# Altium schematic sheet DualETH_CON.SchDoc
size 420 x 297 mm; SheetNumber: 7; SheetTotal: 11; ModifiedBy: -; CheckedDate: -; Title2: Title 2; DivGrp: WUT ISE; Designer: G.Kasprowicz
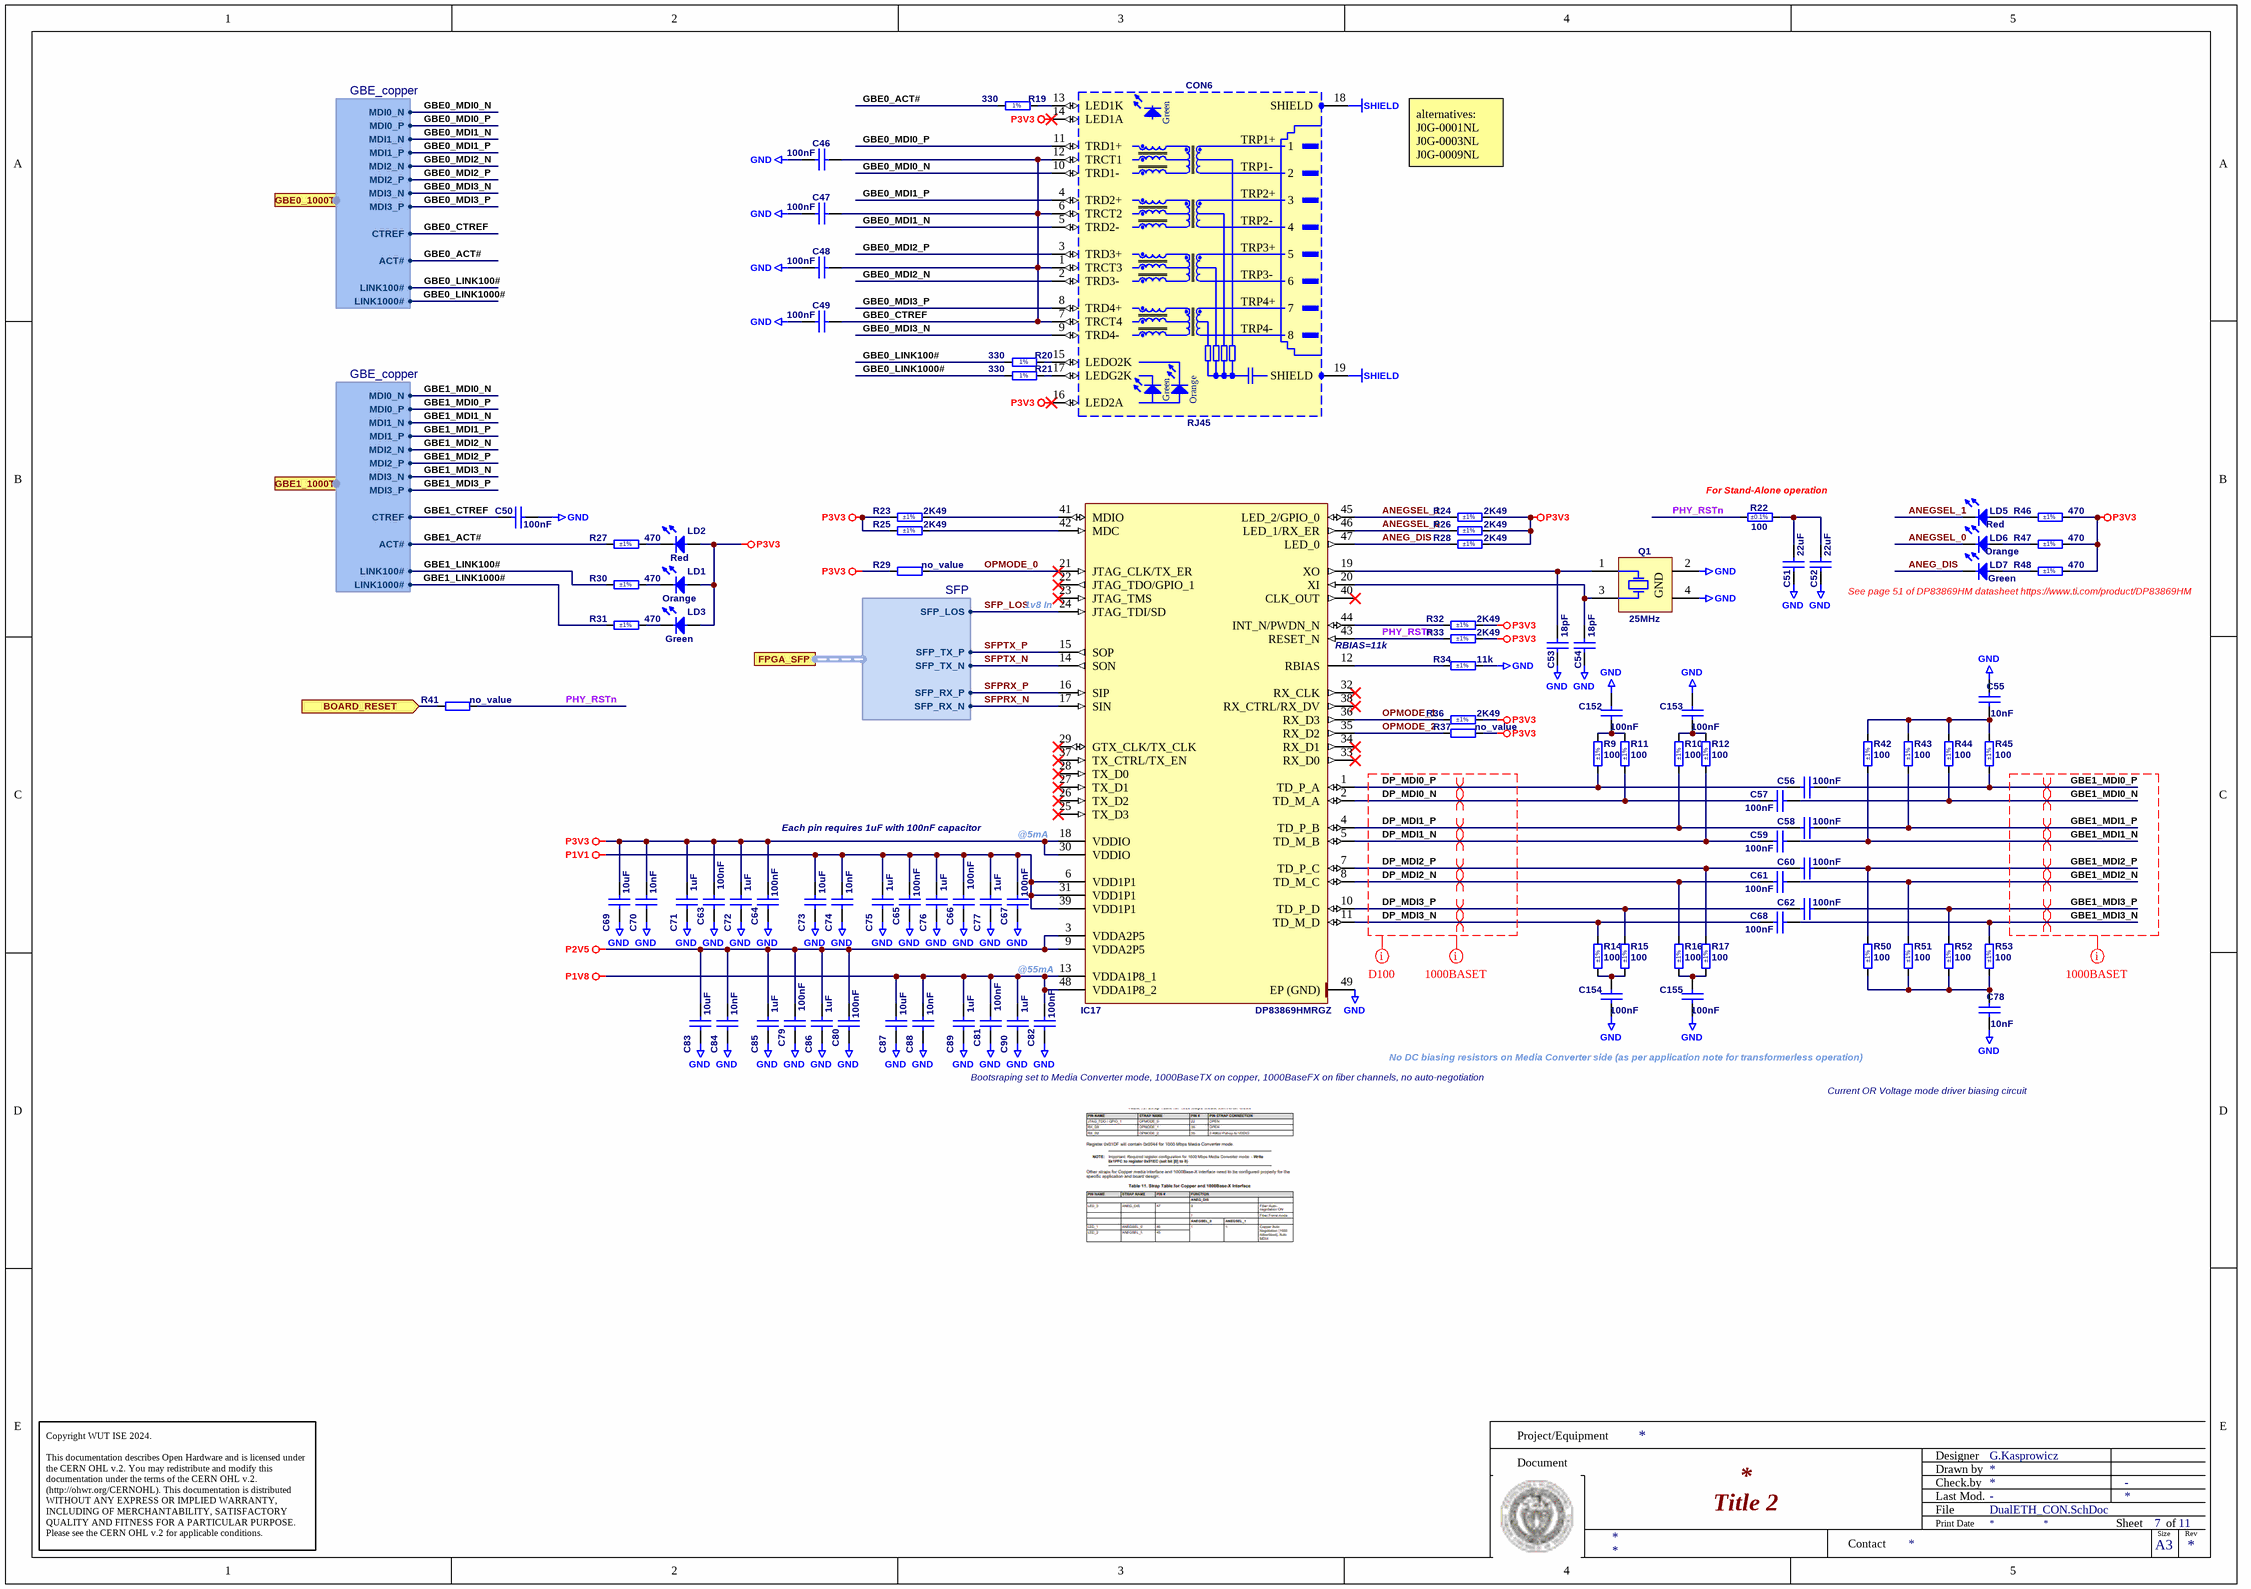
[diagram p0: DualETH_CON.SchDoc]

## Parts
C46  100nF  [CAPC1005X55N]
C47  100nF  [CAPC1005X55N]
C48  100nF  [CAPC1005X55N]
C49  100nF  [CAPC1005X55N]
C50  100nF  [CAPC1005X55N]
C51  22uF  [CAPC2012X135N]
C52  22uF  [CAPC2012X135N]
C53  18pF  [CAPC1005X55N]
C54  18pF  [CAPC1005X55N]
C55  10nF  [CAPC1005X55N]
C56  100nF  [CAPC1005X55N]
C57  100nF  [CAPC1005X55N]
C58  100nF  [CAPC1005X55N]
C59  100nF  [CAPC1005X55N]
C60  100nF  [CAPC1005X55N]
C61  100nF  [CAPC1005X55N]
C62  100nF  [CAPC1005X55N]
C63  100nF  [CAPC1005X55N]
C64  100nF  [CAPC1005X55N]
C65  100nF  [CAPC1005X55N]
C66  100nF  [CAPC1005X55N]
C67  100nF  [CAPC1005X55N]
C68  100nF  [CAPC1005X55N]
C69  10uF  [CAPC1608X80N]
C70  10nF  [CAPC1005X55N]
C71  1uF  [CAPC1005X55N]
C72  1uF  [CAPC1005X55N]
C73  10uF  [CAPC1608X80N]
C74  10nF  [CAPC1005X55N]
C75  1uF  [CAPC1005X55N]
C76  1uF  [CAPC1005X55N]
C77  1uF  [CAPC1005X55N]
C78  10nF  [CAPC1005X55N]
C79  100nF  [CAPC1005X55N]
C80  100nF  [CAPC1005X55N]
C81  100nF  [CAPC1005X55N]
C82  100nF  [CAPC1005X55N]
C83  10uF  [CAPC1608X80N]
C84  10nF  [CAPC1005X55N]
C85  1uF  [CAPC1005X55N]
C86  1uF  [CAPC1005X55N]
C87  10uF  [CAPC1608X80N]
C88  10nF  [CAPC1005X55N]
C89  1uF  [CAPC1005X55N]
C90  1uF  [CAPC1005X55N]
C152  100nF  [CAPC1005X55N]
C153  100nF  [CAPC1005X55N]
C154  100nF  [CAPC1005X55N]
C155  100nF  [CAPC1005X55N]
CON6  RJ45  [BELFUSE_L829-1J1T-43]
IC17  DP83869HMRGZ  [QFN50P700X700X100-49N-S420]
LD1  Orange  [LED_DIALIGHT_597-2111-407F]
LD2  Red  [LED_DIALIGHT_597-2111-407F]
LD3  Green  [LED_DIALIGHT_597-2111-407F]
LD5  Red  [LED_DIALIGHT_597-2111-407F]
LD6  Orange  [LED_DIALIGHT_597-2111-407F]
LD7  Green  [LED_DIALIGHT_597-2111-407F]
Q1  25MHz  [XTAL_EPSON_TSX-3225]
R9  100  Tolerance: ±1%  [RESC1005X40N]
R10  100  Tolerance: ±1%  [RESC1005X40N]
R11  100  Tolerance: ±1%  [RESC1005X40N]
R12  100  Tolerance: ±1%  [RESC1005X40N]
R14  100  Tolerance: ±1%  [RESC1005X40N]
R15  100  Tolerance: ±1%  [RESC1005X40N]
R16  100  Tolerance: ±1%  [RESC1005X40N]
R17  100  Tolerance: ±1%  [RESC1005X40N]
R19  330  [RESC1608X55N]
R20  330  [RESC1608X55N]
R21  330  [RESC1608X55N]
R22  100  Tolerance: ±0.1%  [RESC1005X35N]
R23  2K49  Tolerance: ±1%  [RESC1005X40N]
R24  2K49  Tolerance: ±1%  [RESC1005X40N]
R25  2K49  Tolerance: ±1%  [RESC1005X40N]
R26  2K49  Tolerance: ±1%  [RESC1005X40N]
R27  470  Tolerance: ±1%  [RESC1005X40N]
R28  2K49  Tolerance: ±1%  [RESC1005X40N]
R29  no_value  [RESC1005X40N]  (no BOM)
R30  470  Tolerance: ±1%  [RESC1005X40N]
R31  470  Tolerance: ±1%  [RESC1005X40N]
R32  2K49  Tolerance: ±1%  [RESC1005X40N]
R33  2K49  Tolerance: ±1%  [RESC1005X40N]
R34  11k  Tolerance: ±1%  [RESC1005X40N]
R36  2K49  Tolerance: ±1%  [RESC1005X40N]
R37  no_value  [RESC1005X40N]  (no BOM)
R41  no_value  [RESC1005X40N]  (no BOM)
R42  100  Tolerance: ±1%  [RESC1005X40N]
R43  100  Tolerance: ±1%  [RESC1005X40N]
R44  100  Tolerance: ±1%  [RESC1005X40N]
R45  100  Tolerance: ±1%  [RESC1005X40N]
R46  470  Tolerance: ±1%  [RESC1005X40N]
R47  470  Tolerance: ±1%  [RESC1005X40N]
R48  470  Tolerance: ±1%  [RESC1005X40N]
R50  100  Tolerance: ±1%  [RESC1005X40N]
R51  100  Tolerance: ±1%  [RESC1005X40N]
R52  100  Tolerance: ±1%  [RESC1005X40N]
R53  100  Tolerance: ±1%  [RESC1005X40N]

## Ports
BOARD_RESET (in), FPGA_SFP (harness SFP), GBE0_1000T (harness GBE_copper), GBE1_1000T (harness GBE_copper)

## Harnesses
GBE_copper: MDI2_P, MDI3_N, MDI2_N, MDI3_P, MDI1_P, MDI0_N, MDI1_N, MDI0_P, ACT#, LINK100#, LINK1000#, CTREF
SFP: SFP_TX_P, SFP_TX_N, SFP_RX_P, SFP_RX_N, SFP_LOS

## Nets
GND: C46.1 C47.1 C48.1 C49.1 C50.1 C51.1 C52.1 C53.1 C54.1 C55.2 C63.1 C64.1 C65.1 C66.1 C67.1 C69.1 C70.1 C71.1 C72.1 C73.1 C74.1 C75.1 C76.1 C77.1 C78.1 C79.1 C80.1 C81.1 C82.1 C83.1 C84.1 C85.1 C86.1 C87.1 C88.1 C89.1 C90.1 C152.2 C153.2 C154.1 C155.1 IC17.49(EP_(GND)) Q1.2(GND) Q1.4(GND) R34.2
P1V1: C65.2 C66.2 C67.2 C73.2 C74.2 C75.2 C76.2 C77.2 IC17.6(VDD1P1) IC17.31(VDD1P1) IC17.39(VDD1P1)
P1V8: C81.2 C82.2 C87.2 C88.2 C89.2 C90.2 IC17.13(VDDA1P8_1) IC17.48(VDDA1P8_2)
P2V5: C79.2 C80.2 C83.2 C84.2 C85.2 C86.2 IC17.3(VDDA2P5) IC17.9(VDDA2P5)
P3V3: C63.2 C64.2 C69.2 C70.2 C71.2 C72.2 CON6.14(LED1A) CON6.16(LED2A) IC17.18(VDDIO) IC17.30(VDDIO) LD1.2(A) LD2.2(A) LD3.2(A) R23.1 R24.2 R25.1 R26.2 R28.2 R29.1 R32.2 R33.2 R36.2 R37.2 R46.2 R47.2 R48.2
SHIELD: CON6.18(SHIELD) CON6.19(SHIELD)
BOARD_RESET: R41.1 ; port BOARD_RESET
ANEG_DIS: IC17.47(LED_0) LD7.1(C) R28.1
ANEGSEL_0: IC17.46(LED_1/RX_ER) LD6.1(C) R26.1
ANEGSEL_1: IC17.45(LED_2/GPIO_0) LD5.1(C) R24.1
DP_MDI0_N: C57.1 IC17.2(TD_M_A) R11.1
DP_MDI0_P: C56.1 IC17.1(TD_P_A) R9.1
DP_MDI1_N: C59.1 IC17.5(TD_M_B) R12.1
DP_MDI1_P: C58.1 IC17.4(TD_P_B) R10.1
DP_MDI2_N: C61.1 IC17.8(TD_M_C) R16.2
DP_MDI2_P: C60.1 IC17.7(TD_P_C) R17.2
DP_MDI3_N: C68.1 IC17.11(TD_M_D) R14.2
DP_MDI3_P: C62.1 IC17.10(TD_P_D) R15.2
GBE0_ACT#: R19.1 ; port GBE0_1000T.ACT#
GBE0_CTREF: C46.2 C47.2 C48.2 C49.2 CON6.1(TRCT3) CON6.6(TRCT2) CON6.7(TRCT4) CON6.12(TRCT1) ; port GBE0_1000T.CTREF
GBE0_LINK100#: R20.1 ; port GBE0_1000T.LINK100#
GBE0_LINK1000#: R21.1 ; port GBE0_1000T.LINK1000#
GBE0_MDI0_N: CON6.10(TRD1-) ; port GBE0_1000T.MDI0_N
GBE0_MDI0_P: CON6.11(TRD1+) ; port GBE0_1000T.MDI0_P
GBE0_MDI1_N: CON6.5(TRD2-) ; port GBE0_1000T.MDI1_N
GBE0_MDI1_P: CON6.4(TRD2+) ; port GBE0_1000T.MDI1_P
GBE0_MDI2_N: CON6.2(TRD3-) ; port GBE0_1000T.MDI2_N
GBE0_MDI2_P: CON6.3(TRD3+) ; port GBE0_1000T.MDI2_P
GBE0_MDI3_N: CON6.9(TRD4-) ; port GBE0_1000T.MDI3_N
GBE0_MDI3_P: CON6.8(TRD4+) ; port GBE0_1000T.MDI3_P
GBE1_ACT#: R27.1 ; port GBE1_1000T.ACT#
GBE1_CTREF: C50.2 ; port GBE1_1000T.CTREF
GBE1_LINK100#: R30.1 ; port GBE1_1000T.LINK100#
GBE1_LINK1000#: R31.1 ; port GBE1_1000T.LINK1000#
GBE1_MDI0_N: C57.2 R44.1 ; port GBE1_1000T.MDI0_N
GBE1_MDI0_P: C56.2 R45.1 ; port GBE1_1000T.MDI0_P
GBE1_MDI1_N: C59.2 R42.1 ; port GBE1_1000T.MDI1_N
GBE1_MDI1_P: C58.2 R43.1 ; port GBE1_1000T.MDI1_P
GBE1_MDI2_N: C61.2 R51.2 ; port GBE1_1000T.MDI2_N
GBE1_MDI2_P: C60.2 R50.2 ; port GBE1_1000T.MDI2_P
GBE1_MDI3_N: C68.2 R53.2 ; port GBE1_1000T.MDI3_N
GBE1_MDI3_P: C62.2 R52.2 ; port GBE1_1000T.MDI3_P
OPMODE_0: IC17.21(JTAG_CLK/TX_ER) R29.2
OPMODE_1: IC17.36(RX_D3) R36.1
OPMODE_2: IC17.35(RX_D2) R37.1
PHY_RSTn: IC17.43(RESET_N) R22.1 R33.1 R41.2
SFP_LOS: IC17.24(JTAG_TDI/SD) ; port FPGA_SFP.SFP_LOS
SFPRX_N: IC17.17(SIN) ; port FPGA_SFP.SFP_RX_N
SFPRX_P: IC17.16(SIP) ; port FPGA_SFP.SFP_RX_P
SFPTX_N: IC17.14(SON) ; port FPGA_SFP.SFP_TX_N
SFPTX_P: IC17.15(SOP) ; port FPGA_SFP.SFP_TX_P
NetC51_2: C51.2 C52.2 R22.2
NetC53_2: C53.2 IC17.19(XO) Q1.1(X)
NetC54_2: C54.2 IC17.20(XI) Q1.3(X)
NetC55_1: C55.1 R42.2 R43.2 R44.2 R45.2
NetC78_2: C78.2 R50.1 R51.1 R52.1 R53.1
NetC152_1: C152.1 R9.2 R11.2
NetC153_1: C153.1 R10.2 R12.2
NetC154_2: C154.2 R14.1 R15.1
NetC155_2: C155.2 R16.1 R17.1
NetCON6_13: CON6.13(LED1K) R19.2
NetCON6_15: CON6.15(LEDO2K) R20.2
NetCON6_17: CON6.17(LEDG2K) R21.2
NetIC17_12: IC17.12(RBIAS) R34.1
NetIC17_41: IC17.41(MDIO) R23.2
NetIC17_42: IC17.42(MDC) R25.2
NetIC17_44: IC17.44(INT_N/PWDN_N) R32.1
NetLD1_1: LD1.1(C) R30.2
NetLD2_1: LD2.1(C) R27.2
NetLD3_1: LD3.1(C) R31.2
NetLD5_2: LD5.2(A) R46.1
NetLD6_2: LD6.2(A) R47.1
NetLD7_2: LD7.2(A) R48.1

Not connected (* = marked no-connect by the designer): IC17 22(JTAG_TDO/GPIO_1)* 23(JTAG_TMS)* 25(TX_D3)* 26(TX_D2)* 27(TX_D1)* 28(TX_D0)* 29(GTX_CLK/TX_CLK)* 32(RX_CLK)* 33(RX_D0)* 34(RX_D1)* 37(TX_CTRL/TX_EN)* 38(RX_CTRL/RX_DV)* 40(CLK_OUT)*

## Layout directives
differential pair: DP_MDI0_N, DP_MDI0_P, DP_MDI1_N, DP_MDI1_P, DP_MDI2_N, DP_MDI2_P, DP_MDI3_N, DP_MDI3_P, GBE1_MDI0_N, GBE1_MDI0_P, GBE1_MDI1_N, GBE1_MDI1_P, GBE1_MDI2_N, GBE1_MDI2_P, GBE1_MDI3_N, GBE1_MDI3_P
net class D100: DP_MDI0_N, DP_MDI0_P, DP_MDI1_N, DP_MDI1_P, DP_MDI2_N, DP_MDI2_P, DP_MDI3_N, DP_MDI3_P
net class 1000BASET: DP_MDI0_N, DP_MDI0_P, DP_MDI1_N, DP_MDI1_P, DP_MDI2_N, DP_MDI2_P, DP_MDI3_N, DP_MDI3_P, GBE1_MDI0_N, GBE1_MDI0_P, GBE1_MDI1_N, GBE1_MDI1_P, GBE1_MDI2_N, GBE1_MDI2_P, GBE1_MDI3_N, GBE1_MDI3_P

## Notes on the sheet
- alternatives:
  J0G-0001NL
  J0G-0003NL
  J0G-0009NL
- (near R22) For Stand-Alone operation
- See page 51 of DP83869HM datasheet https://www.ti.com/product/DP83869HM
- (near IC17) 1v8 In
- (near IC17) RBIAS=11k
- Each pin requires 1uF with 100nF capacitor
- @5mA
- @55mA
- No DC biasing resistors on Media Converter side (as per application note for transformerless operation)
- Bootsraping set to Media Converter mode, 1000BaseTX on copper, 1000BaseFX on fiber channels, no auto-negotiation
- Current OR Voltage mode driver biasing circuit
- Project/Equipment
- Document
- Designer
- Drawn by
- Check.by
- Copyright WUT ISE 2024.
  This documentation describes Open Hardware and is licensed under the CERN OHL v.2. You may redistribute and modify this documentation under the terms of the CERN OHL v.2. (http://ohwr.org/CERNOHL). This documentation is distributed WITHOUT ANY EXPRESS OR IMPLIED WARRANTY, INCLUDING OF MERCHANTABILITY, SATISFACTORY QUALITY AND FITNESS FOR A PARTICULAR PURPOSE. Please see the CERN OHL v.2 for applicable conditions.
- Contact
- File
- Last Mod.
- Print Date
- Sheet
- Size
- A3
- of
- Rev
- (in symbol BELFUSE_L829-1J1T-43) Green; TRP1+; TRP1-; TRP2+; TRP2-; TRP3+; TRP3-; TRP4+; TRP4-; Orange
- (in symbol R0603_330R_1%_0.1W_100PPM) 1%

## Library data of the parts
C46-C50 = CC0402_100NF_16V_10%_X7R: Non-polarised capacitor; Part Description: SMD Multilayer Chip Ceramic Capacitor; Manufacturer: GENERIC; Manufacturer1 Part Number: 223878715649; Voltage: 16V; TC: X7R; Tolerance: ±10%; Table: Capacitors SMD; Part Number: CC0402_100NF_16V_10%_X7R; Component Kind: Standard; Component Type: Standard; Pin Count: 2; Value: 100nF; Status: Not Recommended; Manufacturer Part Number: CC0402_100NF_16V_10%_X7R; Case: 0402; Mounted: Yes; Socket: No; SMD: Yes; Manufacturer1 Example: PHYCOMP; Manufacturer1 ComponentHeight: 0.55mm; HelpURL: \\cern.ch\dfs\Applications\Altium\Datasheets\CC0402_X7R_PHYCOMP.pdf; Author: CERN DEM JLC; CreateDate: 2007-12-03; LatestRevisionDate: 2007-12-03
C51 C52 = CC0805_22UF_16V_10%_X5R: Non-polarised capacitor; Manufacturer: GENERIC; Part Description: SMD Multilayer Chip Ceramic Capacitor; Manufacturer1 Part Number: C2012X5R1C226KT; Tolerance: ±10%; Voltage: 16V; TC: X5R; Manufacturer Part Number: CC0805_22UF_16V_10%_X5R; Part Number: CC0805_22UF_16V_10%_X5R; Value: 22uF; Component Kind: Standard; Component Type: Standard; Pin Count: 2; Status: Preferred; Case: 0805; Mounted: Yes; Socket: No; SMD: Yes; Sense: No; Manufacturer1 Example: TDK; Manufacturer1 ComponentHeight: 1.35mm; HelpURL: \\cern.ch\dfs\Applications\Altium\Datasheets\CC0805_X5R_TDK_C.pdf; Author: CERN DEM JLC; CreateDate: 25.10.2012; LatestRevisionDate: 25.10.2012
C53 C54 = CC0402_18PF_50V_5%_C0G: Non-polarised capacitor; Part Description: SMD Multilayer Chip Ceramic Capacitor; Manufacturer: GENERIC; Manufacturer1 Part Number: C0402C180J5GACTU; Voltage: 50V; TC: C0G/NP0; Tolerance: ±5%; Part Number: CC0402_18PF_50V_5%_C0G; Component Kind: Standard; Component Type: Standard; Pin Count: 2; Value: 18pF; Status: Preferred; Manufacturer Part Number: CC0402_18PF_50V_5%_C0G; Case: 0402; Mounted: Yes; Socket: No; SMD: Yes; Sense: No; Manufacturer1 Example: KEMET; Manufacturer1 ComponentHeight: 0.55mm; HelpURL: \\cern.ch\dfs\Applications\Altium\Datasheets\CC0402_C0G_KEMET_(Commercial Grade).pdf; Author: CERN DEM JLC; CreateDate: 04.10.2016; LatestRevisionDate: 04.10.2016
C55 C70 C74 C78 C84 C88 = CC0402_10NF_16V_10%_X7R: Non-polarised capacitor; Part Description: SMD Multilayer Chip Ceramic Capacitor; Manufacturer: GENERIC; Manufacturer1 Part Number: 223878715636; Voltage: 16V; TC: X7R; Tolerance: ±10%; Part Number: CC0402_10NF_16V_10%_X7R; Component Kind: Standard; Component Type: Standard; Pin Count: 2; Value: 10nF; Status: Not Recommended; Manufacturer Part Number: CC0402_10NF_16V_10%_X7R; Case: 0402; Mounted: Yes; Socket: No; SMD: Yes; Sense: No; Manufacturer1 Example: PHYCOMP; Manufacturer1 ComponentHeight: 0.55mm; HelpURL: \\cern.ch\dfs\Applications\Altium\Datasheets\CC0402_X7R_PHYCOMP.pdf; Author: CERN DEM JLC; CreateDate: 03.12.2007; LatestRevisionDate: 03.12.2007
C56-C68 C79-C82 C152-C155 = CC0402_100NF_16V_10%_X7R: Non-polarised capacitor; Part Description: SMD Multilayer Chip Ceramic Capacitor; Manufacturer: GENERIC; Manufacturer1 Part Number: GRM155R71C104KA88D; Voltage: 16V; TC: X7R; Tolerance: ±10%; Part Number: CC0402_100NF_16V_10%_X7R; Component Kind: Standard; Component Type: Standard; Pin Count: 2; Value: 100nF; Status: Not Recommended; Manufacturer Part Number: CC0402_100NF_16V_10%_X7R; Case: 0402; Mounted: Yes; Socket: No; SMD: Yes; Sense: No; Manufacturer1 Example: MURATA; Manufacturer1 ComponentHeight: 0.55mm; HelpURL: \\cern.ch\dfs\Applications\Altium\Datasheets\CC0402_X7R_MURATA_GRM.pdf; Author: CERN DEM JLC; CreateDate: 05/12/2013; LatestRevisionDate: 03/12/2007
C69 C73 C83 C87 = CC0603_10UF_16V_20%_X5R: Non-polarised capacitor; Part Description: SMD Multilayer Chip Ceramic Capacitor; Manufacturer: GENERIC; Manufacturer1 Part Number: GRM188R61C106MA73D; Voltage: 16V; TC: X5R; Tolerance: ±20%; Part Number: CC0603_10UF_16V_20%_X5R; Component Kind: Standard; Component Type: Standard; Pin Count: 2; Value: 10uF; Status: None; Manufacturer Part Number: CC0603_10UF_16V_20%_X5R; Case: 0603; Mounted: Yes; Socket: No; SMD: Yes; Sense: No; Manufacturer1 Example: MURATA; Manufacturer1 ComponentHeight: 0.8mm; HelpURL: \\cern.ch\dfs\Applications\Altium\Datasheets\CC0603_X5R_MURATA_GRM.pdf; Author: CERN DEM MR; CreateDate: 02.03.2016; LatestRevisionDate: 02.03.2016
C71 C72 C75-C77 C85 C86 C89 C90 = CC0402_1UF_16V_10%_X5R: Non-polarised capacitor; Part Description: SMD Multilayer Chip Ceramic Capacitor; Manufacturer: GENERIC; Manufacturer1 Part Number: C1005X5R1C105KT; Voltage: 16V; TC: X5R; Tolerance: ±10%; Part Number: CC0402_1UF_16V_10%_X5R; Component Kind: Standard; Component Type: Standard; Pin Count: 2; Value: 1uF; Status: Preferred; Manufacturer Part Number: CC0402_1UF_16V_10%_X5R; Case: 0402; Mounted: Yes; Socket: No; SMD: Yes; Sense: No; Manufacturer1 Example: TDK; Manufacturer1 ComponentHeight: 0.55mm; HelpURL: \\cern.ch\dfs\Applications\Altium\Datasheets\CC0402_X5R_TDK_C.pdf; Author: CERN DEM JLC; CreateDate: 2012-10-25; LatestRevisionDate: 2012-10-25
CON6 = BELFUSE_L829-1J1T-43: 1 Port, RJ45, Gigabit Ethernet, MagJack Connector Module With Yellow And Green/Orange LEDs,; Part Description: 1 Port, Yellow/ Green-Yellow LEDs,  RJ45 10/100/1000 Gigabit Ethernet, MagJack® Connector Module; Table: Miscellaneous; Part Number: BELFUSE_L829-1J1T-43; Component Kind: Standard; Component Type: Standard; Pin Count: 19; Family: RJ45; Mounted: Yes; Socket: No; SMD: No; Status: None; Manufacturer: BELFUSE; Manufacturer Part Number: L829-1J1T-43; ComponentHeight: 13.3mm; HelpURL: \\cern.ch\dfs\Applications\Altium\Datasheets\BELFUSE_L829-1J1T-43.pdf; Author: CERN DEM JLC; CreateDate: 2011-08-22; LatestRevisionDate: 2012-04-12
IC17 = DP83869HMRGZ: DP83869HM High Immunity 10/100/1000 Ethernet Physical Layer Transceiver WithCopper and Fiber Interface; Manufacturer: TEXAS INSTRUMENTS; PressFit: No; Bonding: No; Part Number: DP83869HMRGZ; Component Kind: Standard; Component Type: Standard; Device: DP83869HMRGZ; PackageDescription: QFN, 0.50mm Pitch, Square; 48 Pin, 7.00mm L X 7.00mm W X 1.00mm H body (w/Thermal Tab 4.20 X 4.20mm), IPC Medium Density; Part Description: High Immunity 10/100/1000 Ethernet Physical Layer Transceiver with Copper and Fiber Interface; Manufacturer Part Number: DP83869HMRGZ; Pin Count: 48; Case: QFN48; Mounted: Yes; Socket: No; SMD: Yes; Sense: No; ComponentHeight: 1mm; Author: CERN DEM HF; HelpURL: \\cern.ch\dfs\Applications\Altium\Datasheets\DP83869HMRGZ.pdf; CreateDate: 24.04.2024; LatestRevisionDate: 24.04.2024
LD1 LD6 = LED_DIALIGHT_597-2111-407F: https://www.mouser.pl/ProductDetail/Kingbright/APA3010SECK-GX?qs=sGAEpiMZZMt82OzCyDsLFKA61kPckac5U%252BKMX0q8m8Q%3D; Part Description: Right Angle SMT GaAIAs Red LED, 597 Series; PressFit: No; Bonding: No; Part Number: LED_DIALIGHT_597-2111-407F; Component Kind: Standard; Component Type: Standard; Color: Orange; PackageDescription: SMT GaAlAs Red LED, Body 3x2mm (1208),  DIALIGHT 597 Series; Manufacturer: DIALIGHT; Manufacturer Part Number: 597-2111-407F; Pin Count: 3; Case: 1208; Mounted: Yes; Socket: No; SMD: Yes; Sense: No; ComponentHeight: 1mm; HelpURL: \\cern.ch\dfs\Applications\Altium\Datasheets\LED_DIALIGHT_597-2111-407F.pdf; Author: CERN DEM JMW; CreateDate: 14.09.2015; LatestRevisionDate: 14.09.2015
LD2 LD5 = LED_DIALIGHT_597-2111-407F: https://www.mouser.pl/ProductDetail/Kingbright/APA3010EC-GX?qs=sGAEpiMZZMt82OzCyDsLFDW2r6KyqONY2QQPZo8KS1I%3D; Part Description: Right Angle SMT GaAIAs Red LED, 597 Series; PressFit: No; Bonding: No; Part Number: LED_DIALIGHT_597-2111-407F; Component Kind: Standard; Component Type: Standard; Color: Red; PackageDescription: SMT GaAlAs Red LED, Body 3x2mm (1208),  DIALIGHT 597 Series; Manufacturer: DIALIGHT; Manufacturer Part Number: 597-2111-407F; Pin Count: 3; Case: 1208; Mounted: Yes; Socket: No; SMD: Yes; Sense: No; ComponentHeight: 1mm; HelpURL: \\cern.ch\dfs\Applications\Altium\Datasheets\LED_DIALIGHT_597-2111-407F.pdf; Author: CERN DEM JMW; CreateDate: 14.09.2015; LatestRevisionDate: 14.09.2015
LD3 LD7 = LED_DIALIGHT_597-2111-407F: https://www.mouser.pl/ProductDetail/Kingbright/APA3010SGC-GX?qs=sGAEpiMZZMt82OzCyDsLFOTeXJMTPP2t8pkIn112vkg%3D; Part Description: Right Angle SMT GaAIAs Red LED, 597 Series; PressFit: No; Bonding: No; Part Number: LED_DIALIGHT_597-2111-407F; Component Kind: Standard; Component Type: Standard; Color: Green; PackageDescription: SMT GaAlAs Red LED, Body 3x2mm (1208),  DIALIGHT 597 Series; Manufacturer: DIALIGHT; Manufacturer Part Number: 597-2111-407F; Pin Count: 3; Case: 1208; Mounted: Yes; Socket: No; SMD: Yes; Sense: No; ComponentHeight: 1mm; HelpURL: \\cern.ch\dfs\Applications\Altium\Datasheets\LED_DIALIGHT_597-2111-407F.pdf; Author: CERN DEM JMW; CreateDate: 14.09.2015; LatestRevisionDate: 14.09.2015
Q1 = XTAL_25MHZ_EPSON_TSX-3225 25.0000MF10Z-AC: Crystal 4 pins 1=XTAL Control 2=GND3=XTAL 4=GND; Part Description: Tolerance: ±10ppm,  Stability:±10ppm, -20°C to 75°C, 9pF, Surface Mount Quartz Crystal, TX-3225 Series; Manufacturer: EPSON; PressFit: No; Bonding: No; Part Number: XTAL_25MHZ_EPSON_TSX-3225 25.0000MF10Z-AC; Component Kind: Standard; Component Type: Standard; PackageDescription: Crystal, Corner Concave; 4 Pin, 2.50mm L X 3.20mm W X 0.6mm H, TSX-3225 Serie; Value: 25MHz; Manufacturer Part Number: TSX-3225 25.0000MF10Z-AC; Pin Count: 4; Mounted: Yes; Socket: No; SMD: Yes; Sense: No; ComponentHeight: 0.6mm; HelpURL: \\cern.ch\dfs\Applications\Altium\Datasheets\XTAL_EPSON_TSX-3225.pdf; ComponentLink1URL: \\cern.ch\dfs\Applications\Altium\Datasheets\XTAL_EPSON_TSX-3225_Ordering-Informations.pdf; ComponentLink1Description: Ordering Informations; Author: CERN DEM JLC; CreateDate: 03.04.2012; LatestRevisionDate: 06.10.2016
R9-R12 R14-R17 R42-R45 R50-R53 = R0402_100R_1%_0.0625W_100PPM: Resistor - 1%; Part Description: General Purpose Thick Film Chip Resistor; Manufacturer: GENERIC; Manufacturer1 Part Number: 232270671001L; TC: ±100ppm/°C; PressFit: No; Part Number: R0402_100R_1%_0.0625W_100PPM; Component Kind: Standard; Component Type: Standard; Pin Count: 2; Value: 100; Status: Not Recommended; Power: 0.0625W; Manufacturer Part Number: R0402_100R_1%_0.0625W_100PPM; Case: 0402; Mounted: Yes; Sense: No; Socket: No; SMD: Yes; Manufacturer1 Example: YAGEO PHYCOMP; Manufacturer1 ComponentHeight: 0.4mm; HelpURL: \\cern.ch\dfs\Applications\Altium\Datasheets\R0402_Phycomp_RC0402.pdf; Author: CERN DEM JLC; CreateDate: 03.12.2007; LatestRevisionDate: 17.10.2012
R19-R21 = R0603_330R_1%_0.1W_100PPM: Resistor - 1%; Part Description: General Purpose Thick Film Chip Resistor; Manufacturer: GENERIC; Manufacturer1 Part Number: NRC06F3300TRF; Power: 0.1W; TC: ±100ppm/°C; Table: Resistors SMD; Part Number: R0603_330R_1%_0.1W_100PPM; Component Kind: Standard; Component Type: Standard; Pin Count: 2; Value: 330; Status: Preferred; Tolerance: ±1%; Manufacturer Part Number: R0603_330R_1%_0.1W_100PPM; Case: 0603; Mounted: Yes; Socket: No; SMD: Yes; Manufacturer1 Example: NIC COMPONENT; Manufacturer1 ComponentHeight: 0.55mm; HelpURL: \\cern.ch\dfs\Applications\Altium\Datasheets\R0603_NIC_NRC.pdf; Author: CERN DEM JLC; CreateDate: 2007-12-03; LatestRevisionDate: 2008-03-13
R22 = R0402_100R_0.1%_0.063W_25PPM: Resistor - 0.1%; Part Description: Thin Film Precision Resistor; Manufacturer: GENERIC; Manufacturer1 Part Number: CPF0402B100RE1; Power: 0.063W; TC: ±25ppm/°C; PressFit: No; Part Number: R0402_100R_0.1%_0.063W_25PPM; Component Kind: Standard; Component Type: Standard; Pin Count: 2; Value: 100; Status: Not Recommended; Manufacturer Part Number: R0402_100R_0.1%_0.063W_25PPM; Case: 0402; Mounted: Yes; Sense: No; Socket: No; SMD: Yes; Manufacturer1 Example: TE CONNECTIVITY; Manufacturer1 ComponentHeight: 0.35mm; HelpURL: \\cern.ch\dfs\Applications\Altium\Datasheets\R0402_TYCO_CPF.pdf; Author: CERN DEM JMW; CreateDate: 22.09.2015; LatestRevisionDate: 22.09.2015
R23-R26 R28 R32 R33 R36 = R0402_2K49_1%_0.063W_100PPM: Resistor - 1%; Part Description: General Purpose Thick Film Chip Resistor; Manufacturer: GENERIC; Manufacturer1 Part Number: CRCW04022K49FK; Power: 0.063W; TC: ±100ppm/°C; PressFit: No; Part Number: R0402_2K49_1%_0.063W_100PPM; Component Kind: Standard; Component Type: Standard; Pin Count: 2; Value: 2K49; Status: None; Manufacturer Part Number: R0402_2K49_1%_0.063W_100PPM; Case: 0402; Mounted: Yes; Sense: No; Socket: No; SMD: Yes; Manufacturer1 Example: VISHAY; Manufacturer1 ComponentHeight: 0.4mm; HelpURL: \\cern.ch\dfs\Applications\Altium\Datasheets\R0402_VISHAY_CRCW e3.pdf; Author: CERN DEM BC; CreateDate: 10.01.2020; LatestRevisionDate: 10.01.2020
R27 R30 R31 R46-R48 = R0402_470R_1%_0.0625W_100PPM: Resistor - 1%; Part Description: General Purpose Thick Film Chip Resistor; Manufacturer: GENERIC; Manufacturer1 Part Number: 232270674701L; TC: ±100ppm/°C; PressFit: No; Part Number: R0402_470R_1%_0.0625W_100PPM; Component Kind: Standard; Component Type: Standard; Pin Count: 2; Value: 470; Status: Not Recommended; Power: 0.0625W; Manufacturer Part Number: R0402_470R_1%_0.0625W_100PPM; Case: 0402; Mounted: Yes; Sense: No; Socket: No; SMD: Yes; Manufacturer1 Example: YAGEO PHYCOMP; Manufacturer1 ComponentHeight: 0.4mm; HelpURL: \\cern.ch\dfs\Applications\Altium\Datasheets\R0402_Phycomp_RC0402.pdf; Author: CERN DEM JLC; CreateDate: 03.12.2007; LatestRevisionDate: 17.10.2012
R29 R37 R41 = R0402_0R_JUMPER: Resistor; Part Description: 1A (0.05R Max DC Resistance) Zero Ohm Jumper; Manufacturer: GENERIC; Manufacturer1 Part Number: 232270591001L; PressFit: No; Part Number: R0402_0R_JUMPER; Component Type: Standard; Pin Count: 2; Value: no_value; Status: Not Recommended; Manufacturer Part Number: R0402_0R_JUMPER; Case: 0402; Mounted: Yes; Sense: No; Socket: No; SMD: Yes; Manufacturer1 Example: YAGEO PHYCOMP; Manufacturer1 ComponentHeight: 0.4mm; HelpURL: \\cern.ch\dfs\Applications\Altium\Datasheets\R0402_Phycomp_RC0402.pdf; Author: CERN DEM JLC; CreateDate: 03.12.2007; LatestRevisionDate: 17.10.2012
R34 = R0402_11K_1%_0.0625W_100PPM: Resistor - 1%; Part Description: General Purpose Thick Film Chip Resistor; Manufacturer: GENERIC; Manufacturer1 Part Number: 232270671103L; TC: ±100ppm/°C; PressFit: No; Part Number: R0402_11K_1%_0.0625W_100PPM; Component Kind: Standard; Component Type: Standard; Pin Count: 2; Value: 11k; Status: Not Recommended; Power: 0.0625W; Manufacturer Part Number: R0402_11K_1%_0.0625W_100PPM; Case: 0402; Mounted: Yes; Sense: No; Socket: No; SMD: Yes; Manufacturer1 Example: YAGEO PHYCOMP; Manufacturer1 ComponentHeight: 0.4mm; HelpURL: \\cern.ch\dfs\Applications\Altium\Datasheets\R0402_Phycomp_RC0402.pdf; Author: CERN DEM JLC; CreateDate: 03.12.2007; LatestRevisionDate: 17.10.2012